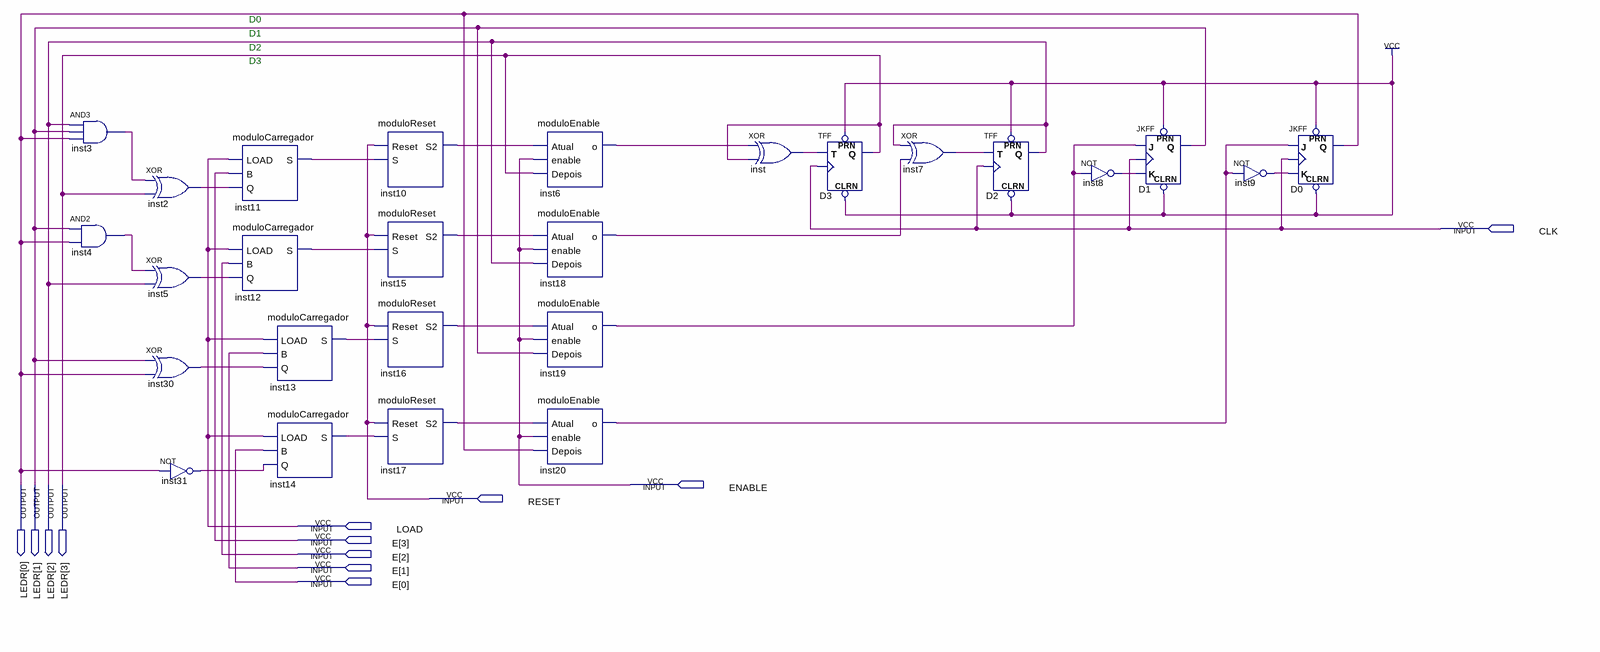
[diagram p0: schematic sheet]
// Quartus schematic Reset.bdf as structural Verilog: 26 symbols, 12 pins
module Reset (
  input  CLK,
  input  ENABLE,
  input  RESET,
  input  LOAD,
  input  [3:0] E,
  output [3:0] LEDR
);

  wire inst2_out, inst3_out, inst4_out, inst5_out, inst6_o, inst7_out, inst8_out, inst9_out, inst10_s2,
       inst11_s, inst12_s, inst13_s, inst14_s, inst15_s2, inst16_s2, inst17_s2, inst18_o, inst19_o, inst20_o,
       inst30_out, inst31_out, inst_out;

  and inst3 (inst3_out, LEDR[2], LEDR[1], LEDR[0]);
  and inst4 (inst4_out, LEDR[1], LEDR[0]);
  xor inst2 (inst2_out, inst3_out, LEDR[3]);
  xor inst5 (inst5_out, inst4_out, LEDR[2]);
  xor inst30 (inst30_out, LEDR[1], LEDR[0]);
  not inst31 (inst31_out, LEDR[0]);
  moduloCarregador inst11 (.LOAD(LOAD), .B(E[3]), .Q(inst2_out), .S(inst11_s));
  moduloCarregador inst12 (.LOAD(LOAD), .B(E[2]), .Q(inst5_out), .S(inst12_s));
  moduloCarregador inst13 (.LOAD(LOAD), .B(E[1]), .Q(inst30_out), .S(inst13_s));
  moduloCarregador inst14 (.LOAD(LOAD), .B(E[0]), .Q(inst31_out), .S(inst14_s));
  moduloReset inst10 (.Reset(RESET), .S(inst11_s), .S2(inst10_s2));
  moduloReset inst15 (.Reset(RESET), .S(inst12_s), .S2(inst15_s2));
  moduloReset inst16 (.Reset(RESET), .S(inst13_s), .S2(inst16_s2));
  moduloReset inst17 (.Reset(RESET), .S(inst14_s), .S2(inst17_s2));
  moduloEnable inst6 (.Atual(inst10_s2), .enable(ENABLE), .Depois(LEDR[3]), .o(inst6_o));
  moduloEnable inst18 (.Atual(inst15_s2), .enable(ENABLE), .Depois(LEDR[2]), .o(inst18_o));
  moduloEnable inst19 (.Atual(inst16_s2), .enable(ENABLE), .Depois(LEDR[1]), .o(inst19_o));
  moduloEnable inst20 (.Atual(inst17_s2), .enable(ENABLE), .Depois(LEDR[0]), .o(inst20_o));
  xor inst (inst_out, inst6_o, LEDR[3]);
  TFF D3 (.PRN(1'b1), .CLRN(1'b1), .T(inst_out), .CLK(CLK), .Q(LEDR[3]));
  xor inst7 (inst7_out, LEDR[2], inst18_o);
  TFF D2 (.PRN(1'b1), .CLRN(1'b1), .T(inst7_out), .CLK(CLK), .Q(LEDR[2]));
  not inst8 (inst8_out, inst19_o);
  JKFF D1 (.PRN(1'b1), .CLRN(1'b1), .K(inst8_out), .J(inst19_o), .CLK(CLK), .Q(LEDR[1]));
  not inst9 (inst9_out, inst20_o);
  JKFF D0 (.PRN(1'b1), .CLRN(1'b1), .K(inst9_out), .J(inst20_o), .CLK(CLK), .Q(LEDR[0]));

  // Notes on the sheet:
  //   D0
  //   D1
  //   D2
  //   D3
endmodule
